# Altium schematic sheet Headers.SchDoc
size A; SheetNumber: 4; SheetTotal: 4
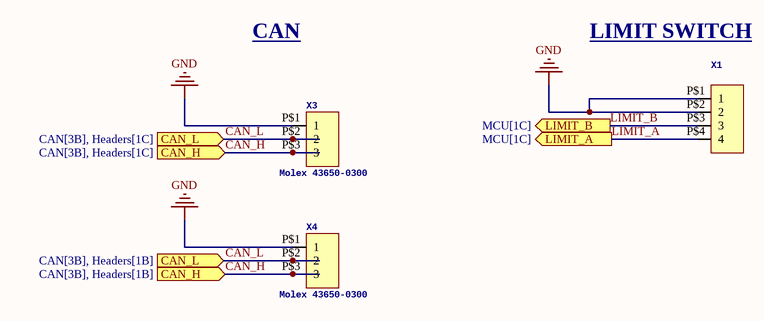
[diagram p0: Headers.SchDoc]

## Parts
X1  Molex - Micro-Fit 3.0 Series connector,  3.00mm (0.118") pitch header, 4 positions.  [43045-0400]  (value not drawn)
X3  Molex 43650-0300  [43650-0300]
X4  Molex 43650-0300  [43650-0300]

## Ports
CAN_H (in, see CAN[3B], Headers[1B]), CAN_H (in, see CAN[3B], Headers[1C]), CAN_L (in, see CAN[3B], Headers[1B]), CAN_L (in, see CAN[3B], Headers[1C]), LIMIT_A (out, see MCU[1C]), LIMIT_B (out, see MCU[1C])

## Nets
GND: X1.P$1(1) X1.P$2(2) X3.P$1(1) X4.P$1(1)
CAN_H: X3.P$3(3) X4.P$3(3) ; port CAN_H
CAN_L: X3.P$2(2) X4.P$2(2) ; port CAN_L
LIMIT_A: X1.P$4(4) ; port LIMIT_A
LIMIT_B: X1.P$3(3) ; port LIMIT_B

## Notes on the sheet
- CAN
- LIMIT SWITCH

## Library data of the parts
X1 = HEADER_POS4_?43045-0401: GateName_1: G$1; SymbolName_1: HEADER_POS4; DeviceName: 43045-0401; LibraryName: con-molex-micro-fit-3_0_2; DeviceSetName: HEADER_POS4_?; Package: 43045-0400
X3 X4 = Micro-Fit Molex 3 Pin Right Angle: GateName_1: G$1; SymbolName_1: HEADER_POS3; DeviceSetName: HEADER_POS3_?; DeviceName: 43650-0300; LibraryName: con-molex-micro-fit-3_0_2; Package: 43650-0300